# EAGLE design Battery_Monitoring_V3 (EAGLE 9.6.2)

## Sheet 1 of 2
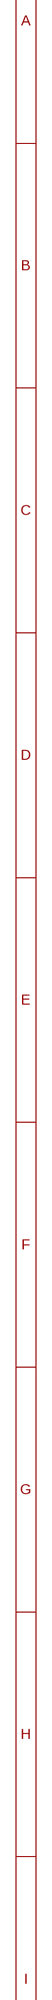
[diagram p0: schematic, sheet 1, part 1 of 2]
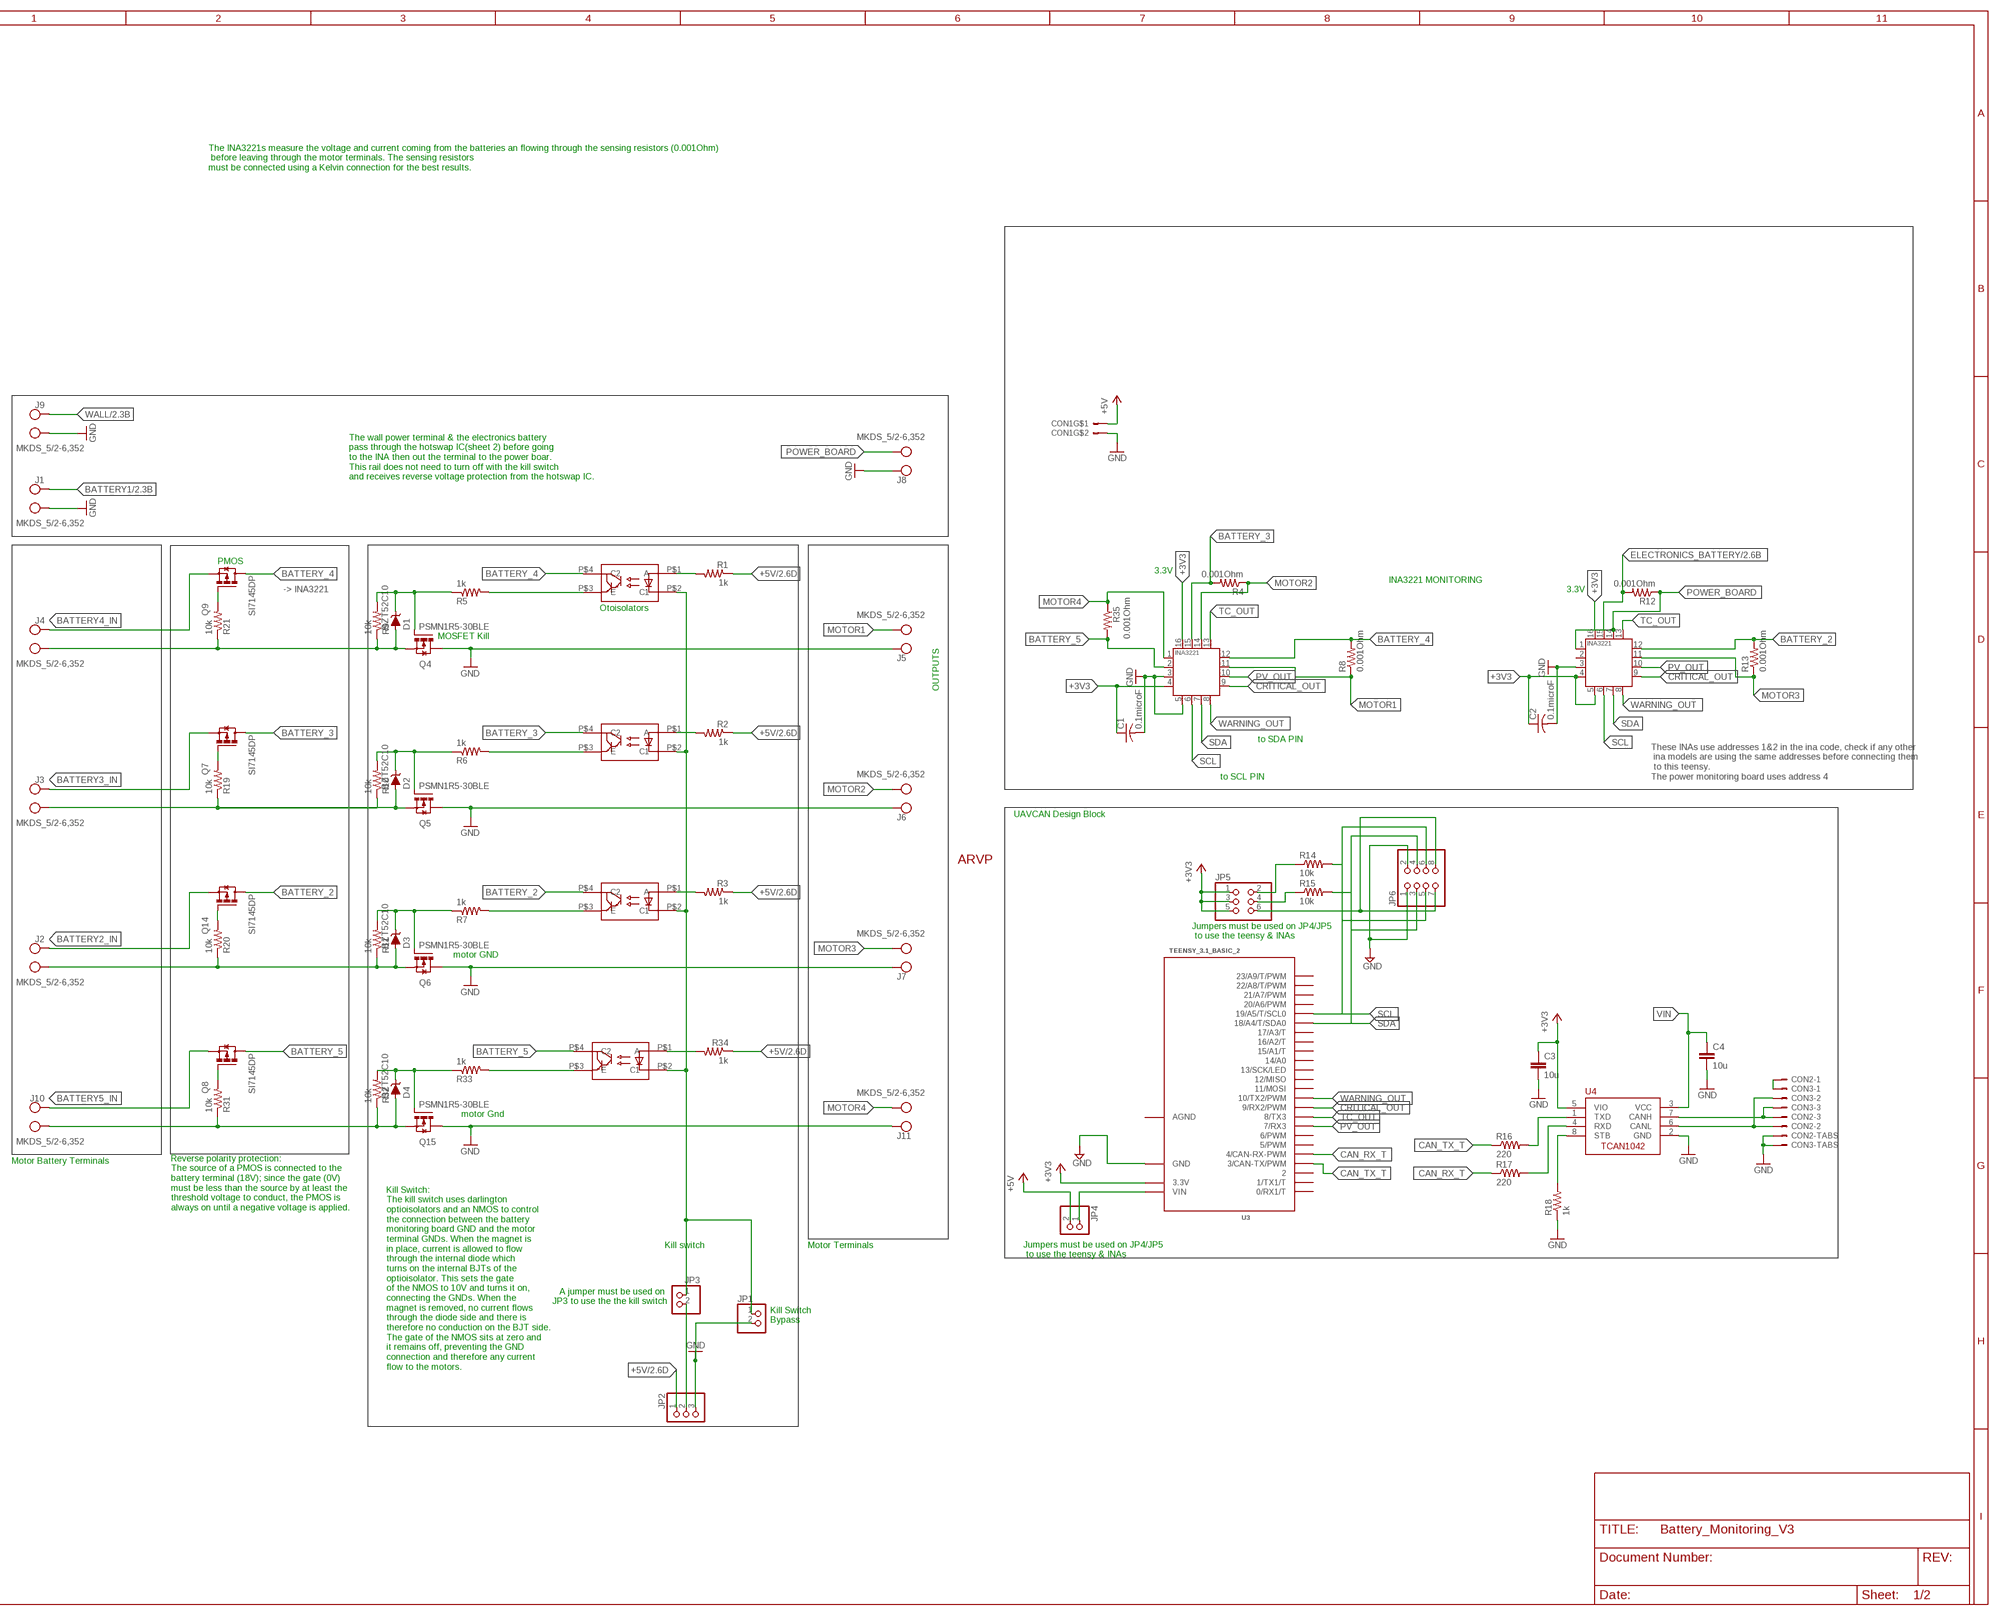
[diagram p1: schematic, sheet 1, part 2 of 2]

### Parts
ARVP1  ARVP_LOGO  [ARVP]
C1  0.1microF  C-USC2012  [C2012]
C2  0.1microF  C-USC2012  [C2012]
C3  10u  C-EUC0805  [C0805]
C4  10u  C-EUC0805  [C0805]
CON1  MOLEX_5566-2  [5566-2]
CON2  SM03B-GHS-TB  [SM03B-GHS-TB]
CON3  SM03B-GHS-TB  [SM03B-GHS-TB]
D1  BZT52C10  [SOD-123]
D2  BZT52C10  [SOD-123]
D3  BZT52C10  [SOD-123]
D4  BZT52C10  [SOD-123]
J1  MKDS_5/2-6,352  [MKDS_5/2-6,35]
J2  MKDS_5/2-6,352  [MKDS_5/2-6,35]
J3  MKDS_5/2-6,352  [MKDS_5/2-6,35]
J4  MKDS_5/2-6,352  [MKDS_5/2-6,35]
J5  MKDS_5/2-6,352  [MKDS_5/2-6,35]
J6  MKDS_5/2-6,352  [MKDS_5/2-6,35]
J7  MKDS_5/2-6,352  [MKDS_5/2-6,35]
J8  MKDS_5/2-6,352  [MKDS_5/2-6,35]
J9  MKDS_5/2-6,352  [MKDS_5/2-6,35]
J10  MKDS_5/2-6,352  [MKDS_5/2-6,35]
J11  MKDS_5/2-6,352  [MKDS_5/2-6,35]
JP1  PINHD-1X2  [1X02]
JP2  PINHD-1X3  [1X03]
JP3  PINHD-1X2  [1X02]
JP4  PINHD-1X2  [1X02]
JP5  PINHD-2X3  [2X03]
JP6  PINHD-2X4  [2X04]
Q1  TCLD1000CT  [SOP-4L]
Q2  TCLD1000CT  [SOP-4L]
Q3  TCLD1000CT  [SOP-4L]
Q4  PSMN1R5-30BLE  [SOT404/D2PAK]
Q5  PSMN1R5-30BLE  [SOT404/D2PAK]
Q6  PSMN1R5-30BLE  [SOT404/D2PAK]
Q7  SI7145DP  [SO-8/PPAK/TEST]
Q8  SI7145DP  [SO-8/PPAK/TEST]
Q9  SI7145DP  [SO-8/PPAK/TEST]
Q14  SI7145DP  [SO-8/PPAK/TEST]
Q15  PSMN1R5-30BLE  [SOT404/D2PAK]
Q16  TCLD1000CT  [SOP-4L]
R1  1k  R-US_R0805  [R0805]
R2  1k  R-US_R0805  [R0805]
R3  1k  R-US_R0805  [R0805]
R4  0.001Ohm  HCS3920FT1L00  [3920]
R5  1k  R-US_M1206  [M1206]
R6  1k  R-US_M1206  [M1206]
R7  1k  R-US_M1206  [M1206]
R8  0.001Ohm  HCS3920FT1L00  [3920]
R9  10k  R-US_M1206  [M1206]
R10  10k  R-US_M1206  [M1206]
R11  10k  R-US_M1206  [M1206]
R12  0.001Ohm  HCS3920FT1L00  [3920]
R13  0.001Ohm  HCS3920FT1L00  [3920]
R14  10k  R-US_R1206  [R1206]
R15  10k  R-US_R1206  [R1206]
R16  220  R-US_R0805  [R0805]
R17  220  R-US_R0805  [R0805]
R18  1k  R-US_R0805  [R0805]
R19  10k  R-US_M1206  [M1206]
R20  10k  R-US_M1206  [M1206]
R21  10k  R-US_M1206  [M1206]
R31  10k  R-US_M1206  [M1206]
R32  10k  R-US_M1206  [M1206]
R33  1k  R-US_M1206  [M1206]
R34  1k  R-US_R0805  [R0805]
R35  0.001Ohm  HCS3920FT1L00  [3920]
U1  INA3221.  [HVQFN16_4X4]
U2  INA3221.  [HVQFN16_4X4]
U3  TEENSY_3.1_BASIC_2  [TEENSY_3.1_BASIC_2]
U4  TCAN1042HVDR  [SO-8]

### Nets
+3V3: C1.1 C2.1 C3.1 JP5.1 JP5.3 JP5.5 U1.4(VS) U1.16(VPU) U2.4(VS) U2.5(A0) U2.16(VPU) U3.3.3V U4.5(VIO)
+5V: CON1.1 JP2.1 JP4.2 R1.1 R2.1 R3.1 R34.1 ; also sheet 2
BATT1GND: D1.P$2(A) J4.1(KL) Q4.3S(S) R9.1 R21.1
BATT2GND: D2.P$2(A) J3.1(KL) Q5.3S(S) R10.1 R19.1
BATT3GND: D3.P$2(A) J2.1(KL) Q6.3S(S) R11.1 R20.1
BATT5GND: D4.P$2(A) J10.1(KL) Q15.3S(S) R31.1 R32.1
BATTERY1: J1.2(KL1) ; also sheet 2
BATTERY2_IN: J2.2(KL1) Q14.S@1(S) Q14.S@2(S) Q14.S@3(S)
BATTERY3_IN: J3.2(KL1) Q7.S@1(S) Q7.S@2(S) Q7.S@3(S)
BATTERY4_IN: J4.2(KL1) Q9.S@1(S) Q9.S@2(S) Q9.S@3(S)
BATTERY5_IN: J10.2(KL1) Q8.S@1(S) Q8.S@2(S) Q8.S@3(S)
BATTERY_2: Q3.P$4(C2) Q14.D@1(D) Q14.D@2(D) Q14.D@3(D) Q14.D@4(D) Q14.D@5(D) R13.P$2 U2.12(IN+1)
BATTERY_3: Q2.P$4(C2) Q7.D@1(D) Q7.D@2(D) Q7.D@3(D) Q7.D@4(D) Q7.D@5(D) R4.P$2 U1.15(IN+2)
BATTERY_4: Q1.P$4(C2) Q9.D@1(D) Q9.D@2(D) Q9.D@3(D) Q9.D@4(D) Q9.D@5(D) R8.P$2 U1.12(IN+1)
BATTERY_5: Q8.D@1(D) Q8.D@2(D) Q8.D@3(D) Q8.D@4(D) Q8.D@5(D) Q16.P$4(C2) R35.P$2 U1.2(IN+3)
CAN_RX1: R17.2 U4.4(RXD)
CAN_RX_T: R17.1 U3.4(4/CAN-RX-PWM)
CAN_TX2: R16.2 U4.1(TXD)
CAN_TX_T: R16.1 U3.3(3/CAN-TX/PWM)
CANH1: CON2.P$3 CON3.P$3 U4.7(CANH)
CANL1: CON2.P$2 CON3.P$2 U4.6(CANL)
CANSH1: CON2.P$1 CON3.P$1
CRITICAL_OUT: U1.9(CRITICAL) U2.9(CRITICAL) U3.9(9/RX2/PWM)
E1: Q1.P$3(E) R5.2
E2: Q2.P$3(E) R6.2
E3: Q3.P$3(E) R7.2
ELECTRONICS_BATTERY: R12.P$2 U2.15(IN+2) ; also sheet 2
GND: C1.2 C2.2 C3.2 C4.2 CON1.2 CON2.P$4 CON2.P$5 CON3.P$4 CON3.P$5 J1.1(KL) J5.2(KL1) J6.2(KL1) J7.2(KL1) J8.2(KL1) J9.1(KL) J11.2(KL1) JP1.2 JP2.3 JP6.1 JP6.2 Q4.2D(D) Q5.2D(D) Q6.2D(D) Q15.2D(D) R18.1 U1.3(GND) U1.5(A0) U2.3(GND) U3.GND U4.2(GND) ; also sheet 2
I2C_3V1: JP5.6 JP6.7 JP6.8
MG1: D1.P$1(C) Q4.1G(G) R5.1 R9.2
MG2: D2.P$1(C) Q5.1G(G) R6.1 R10.2
MG3: D3.P$1(C) Q6.1G(G) R7.1 R11.2
MG4: D4.P$1(C) Q15.1G(G) R32.2 R33.1
MOTOR1: J5.1(KL) R8.P$1 U1.11(IN-1)
MOTOR2: J6.1(KL) R4.P$1 U1.14(IN-2)
MOTOR3: J7.1(KL) R13.P$1 U2.11(IN-1)
MOTOR4: J11.1(KL) R35.P$1 U1.1(IN-3)
N$1: Q1.P$1(A) R1.2
N$2: Q2.P$1(A) R2.2
N$3: Q3.P$1(A) R3.2
N$4: JP1.1 JP3.1 Q1.P$2(C1) Q2.P$2(C1) Q3.P$2(C1) Q16.P$2(C1)
N$5: JP2.2 JP3.2
N$6: Q7.G R19.2
N$7: Q14.G R20.2
N$9: Q9.G R21.2
N$10: Q8.G R31.2
N$15: Q16.P$3(E) R33.2
N$16: Q16.P$1(A) R34.2
POWER_BOARD: J8.1(KL) R12.P$1 U2.1(IN-3) U2.14(IN-2)
PV_OUT: U1.10(PV) U2.10(PV) U3.7(7/RX3)
SCL: JP6.5 JP6.6 R14.2 U1.6(SCL) U2.6(SCL) U3.19/A5(19/A5/T/SCL0)
SCL_3V1: JP5.2 R14.1
SDA: JP6.3 JP6.4 R15.2 U1.7(SDA) U2.7(SDA) U3.18/A4(18/A4/T/SDA0)
SDA_3V1: JP5.4 R15.1
STB1: R18.2 U4.8(STB)
TC_OUT: U1.13(TC) U2.13(TC) U3.8(8/TX3)
VIN: C4.1 JP4.1 U3.VIN U4.3(VCC)
WALL: J9.2(KL1) ; also sheet 2
WARNING_OUT: U1.8(WARNING) U2.8(WARNING) U3.10(10/TX2/PWM)
Unconnected: U2.2(IN+3) U3.0(0/RX1/T) U3.1(1/TX1/T) U3.2 U3.5(5/PWM) U3.6(6/PWM) U3.11(11/MOSI) U3.12(12/MISO) U3.13(13/SCK/LED) U3.14/A0 U3.15/A1(15/A1/T) U3.16/A2(16/A2/T) U3.17/A3(17/A3/T) U3.20/A6(20/A6/PWM) U3.21/A7(21/A7/PWM) U3.22/A8(22/A8/T/PWM) U3.23/A9(23/A9/T/PWM)

### Notes on the sheet
- The INA3221s measure the voltage and current coming from the batteries an flowing through the sensing resistors (0.001Ohm)
   before leaving through the motor terminals. The sensing resistors
  must be connected using a Kelvin connection for the best results.
- The wall power terminal & the electronics battery
  pass through the hotswap IC(sheet 2) before going 
  to the INA then out the terminal to the power boar. 
  This rail does not need to turn off with the kill switch 
  and receives reverse voltage protection from the hotswap IC.
- PMOS
- 3.3V
- INA3221 MONITORING
- -> INA3221 | 3.3V
- Otoisolators
- MOSFET Kill
- OUTPUTS
- to SDA PIN
- to SCL PIN
- These INAs use addresses 1&2 in the ina code, check if any other
   ina models are using the same addresses before connecting them
   to this teensy.
  The power monitoring board uses address 4
- UAVCAN Design Block
- Jumpers must be used on JP4/JP5
   to use the teensy & INAs
- motor GND
- motor Gnd
- Motor Battery Terminals
- Reverse polarity protection:
  The source of a PMOS is connected to the 
  battery terminal (18V); since the gate (0V) 
  must be less than the source by at least the 
  threshold voltage to conduct, the PMOS is 
  always on until a negative voltage is applied.
- Kill switch | Motor Terminals
- Jumpers must be used on JP4/JP5
   to use the teensy & INAs
- A jumper must be used on 
  JP3 to use the the kill switch
- Kill Switch 
  Bypass
- Kill Switch:
  The kill switch uses darlington 
  optioisolators and an NMOS to control 
  the connection between the battery 
  monitoring board GND and the motor 
  terminal GNDs. When the magnet is 
  in place, current is allowed to flow 
  through the internal diode which 
  turns on the internal BJTs of the 
  optioisolator. This sets the gate
  of the NMOS to 10V and turns it on,
  connecting the GNDs. When the 
  magnet is removed, no current flows 
  through the diode side and there is 
  therefore no conduction on the BJT side. 
  The gate of the NMOS sits at zero and 
  it remains off, preventing the GND 
  connection and therefore any current 
  flow to the motors.

## Sheet 2 of 2
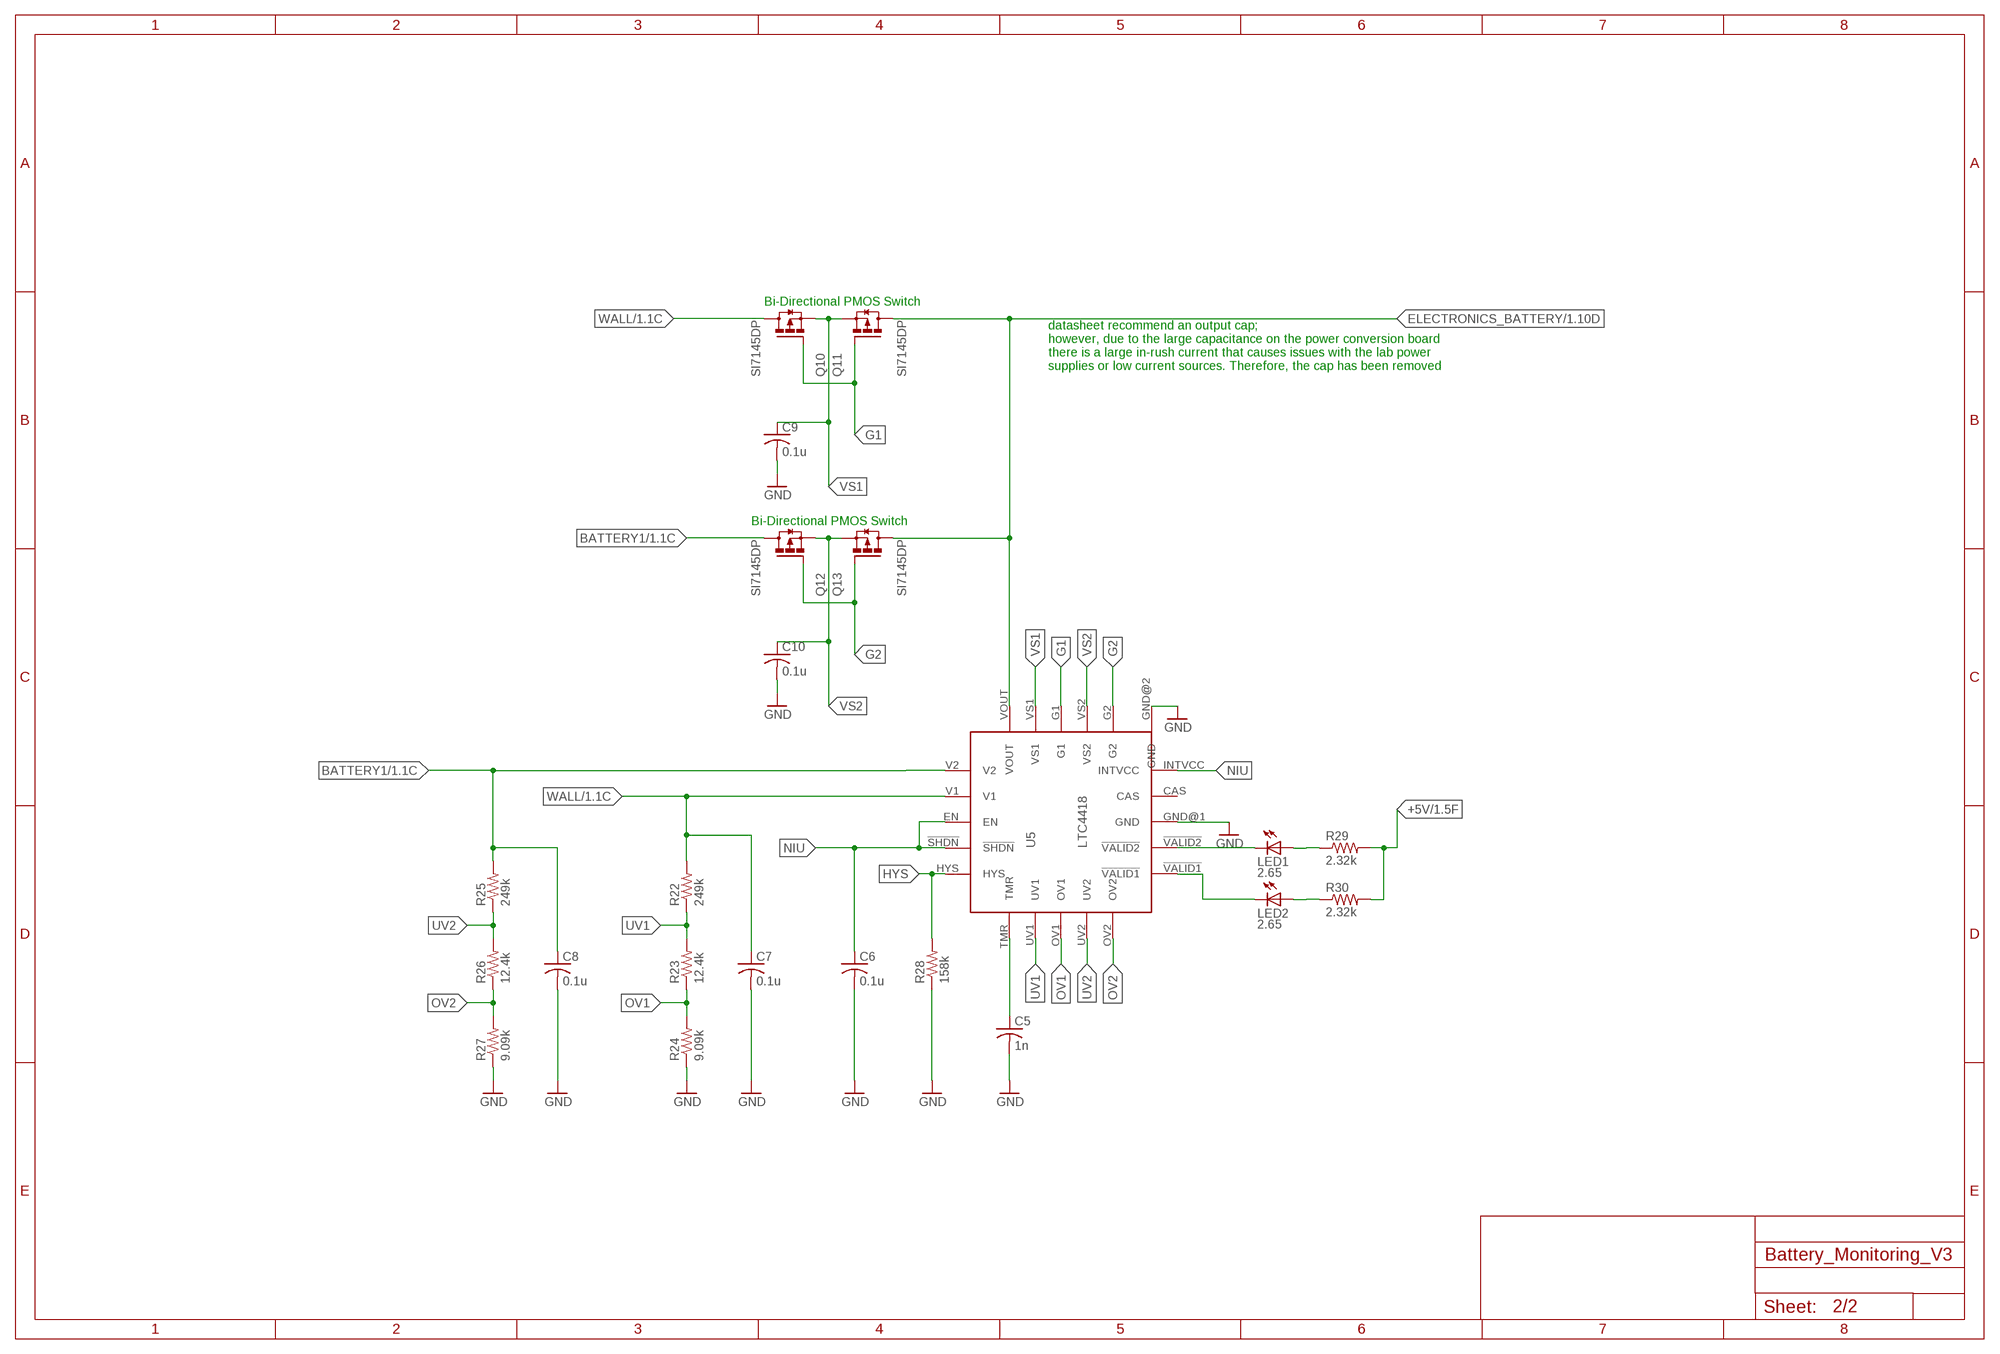
[diagram p2: schematic, sheet 2]

### Parts
C5  1n  C-USC0805  [C0805]
C6  0.1u  C-USC0805  [C0805]
C7  0.1u  C-USC0805  [C0805]
C8  0.1u  C-USC0805  [C0805]
C9  0.1u  C-USC0805  [C0805]
C10  0.1u  C-USC0805  [C0805]
LED1  2.65  LEDSML0805  [SML0805]
LED2  2.65  LEDSML0805  [SML0805]
Q10  SI7145DP  [SO-8/PPAK/TEST]
Q11  SI7145DP  [SO-8/PPAK/TEST]
Q12  SI7145DP  [SO-8/PPAK/TEST]
Q13  SI7145DP  [SO-8/PPAK/TEST]
R22  249k  R-US_R1206  [R1206]
R23  12.4k  R-US_R0805  [R0805]
R24  9.09k  R-US_R0805  [R0805]
R25  249k  R-US_R1206  [R1206]
R26  12.4k  R-US_R0805  [R0805]
R27  9.09k  R-US_R0805  [R0805]
R28  158k  R-US_R0805  [R0805]
R29  2.32k  R-US_R0805  [R0805]
R30  2.32k  R-US_R0805  [R0805]
U5  LTC4418  [20-QFN(4X4)]

### Nets
!VALID1: LED2.C U5.!VALID1
!VALID2: LED1.C U5.!VALID2
+5V: R29.2 R30.2 ; also sheet 1
BATTERY1: C8.1 Q12.D@1(D) Q12.D@2(D) Q12.D@3(D) Q12.D@4(D) Q12.D@5(D) R25.2 U5.V2 ; also sheet 1
ELECTRONICS_BATTERY: Q11.D@1(D) Q11.D@2(D) Q11.D@3(D) Q11.D@4(D) Q11.D@5(D) Q13.D@1(D) Q13.D@2(D) Q13.D@3(D) Q13.D@4(D) Q13.D@5(D) U5.VOUT ; also sheet 1
G1: Q10.G Q11.G U5.G1
G2: Q12.G Q13.G U5.G2
GND: C5.2 C6.2 C7.2 C8.2 C9.2 C10.2 R24.1 R27.1 R28.1 U5.GND@1(GND) U5.GND@2(GND) ; also sheet 1
HYS: R28.2 U5.HYS
N$8: LED1.A R29.1
N$11: LED2.A R30.1
N$14: C5.1 U5.TMR
NIU: C6.1 U5.!SHDN U5.EN U5.INTVCC
OV1: R23.1 R24.2 U5.OV1
OV2: R26.1 R27.2 U5.OV2
UV1: R22.1 R23.2 U5.UV1
UV2: R25.1 R26.2 U5.UV2
VS1: C9.1 Q10.S@1(S) Q10.S@2(S) Q10.S@3(S) Q11.S@1(S) Q11.S@2(S) Q11.S@3(S) U5.VS1
VS2: C10.1 Q12.S@1(S) Q12.S@2(S) Q12.S@3(S) Q13.S@1(S) Q13.S@2(S) Q13.S@3(S) U5.VS2
WALL: C7.1 Q10.D@1(D) Q10.D@2(D) Q10.D@3(D) Q10.D@4(D) Q10.D@5(D) R22.2 U5.V1 ; also sheet 1
Unconnected: U5.CAS

### Notes on the sheet
- Bi-Directional PMOS Switch
- datasheet recommend an output cap;
  however, due to the large capacitance on the power conversion board 
  there is a large in-rush current that causes issues with the lab power 
  supplies or low current sources. Therefore, the cap has been removed
- Bi-Directional PMOS Switch

## Power pins joined to a net without a drawn wire
AGND: U3.AGND

## Library data of the parts
ARVP1 = ARVP:ARVP_LOGO
C1 C2 = resistor:C-US: CAPACITOR, American symbol
C3 C4 = rcl:C-EU: CAPACITOR, European symbol
C5-C10 = adafruit:C-US: CAPACITOR, American symbol
CON1 = ARVP:MOLEX_5566-2
CON2 CON3 = ARVP:SM03B-GHS-TB
D1-D4 = Moira:BZT52C10: DIODE ZENER 10V 500MW SOD123 by Diodes Incorporated Digikey: BZT52C10-FDICT-ND
J1-J11 = Moira:MKDS_5/2-6,35: CONN TERM BLOCK 2POS 6.35MM PCB, 2 Position Wire to Board Terminal Block Horizontal with Board 0.250" (6.35mm) Through Hole, Phoenix Contact (1714955), Digikey:277-1269-ND, MKDS 5/2-6,35 package adpated from Eagle library package MKDS 5/3-6,35
JP1 JP3 JP4 = pinhead:PINHD-1X2: PIN HEADER
JP2 = pinhead:PINHD-1X3: PIN HEADER
JP5 = pinhead:PINHD-2X3: PIN HEADER
JP6 = pinhead:PINHD-2X4: PIN HEADER
LED1 LED2 = led:LED: LED OSRAM: - CHIPLED LG R971, LG N971, LY N971, LG Q971, LY Q971, LO R971, LY R971 LH N974, LH R974 LS Q976, LO Q976, LY Q976 LO Q996 - Hyper CHIPLED LW Q18S LB Q993, LB Q99A, LB R99A - SideLED LS A670, LO A670, LY A670, LG A670, LP A670 LB A673, LV A673, LT A673, LW A673 LH A674 LY A675 LS A676, LA A676, LO A676, LY A676, LW A676 LS A679, LY A679, LG A679 - Hyper Micro SIDELED® LS Y876, LA Y876, LO Y876, LY Y876 LT Y87S - SmartLED LW L88C, LW L88S LB L89C, LB L89S, LG L890 LS L89K, LO L89K, LY L89K LS L896, LA L896, LO L896, LY L896 - TOPLED LS T670, LO T670, LY T670, LG T670, LP T670 LSG T670, LSP T670, LSY T670, LOP T670, LYG T670 LG T671, LOG T671, LSG T671 LB T673, LV T673, LT T673, LW T673 LH T674 LS T676, LA T676, LO T676, LY T676, LB T676, LH T676, LSB T676, LW T676 LB T67C, LV T67C, LT T67C, LS T67K, LO T67K, LY T67K, LW E67C LS E67B, LA E67B, LO E67B, LY E67B, LB E67C, LV E67C, LT E67C LW T67C LS T679, LY T679, LG T679 LS T770, LO T770, LY T770, LG T770, LP T770 LB T773, LV T773, LT T773, LW T773 LH T774 LS E675, LA E675, LY E675, LS T675 LS T776, LA T776, LO T776, LY T776, LB T776 LHGB T686 LT T68C, LB T68C - Hyper Mini TOPLED® LB M676 - Mini TOPLED Santana® LG M470 LS M47K, LO M47K, LY M47K Source: http://www.osram.convergy.de LUXEON: - LUMILED® LXK2-PW12-R00, LXK2-PW12-S00, LXK2-PW14-U00, LXK2-PW14-V00 LXK2-PM12-R00, LXK2-PM12-S00, LXK2-PM14-U00 LXK2-PE12-Q00, LXK2-PE12-R00, LXK2-PE12-S00, LXK2-PE14-T00, LXK2-PE14-U00 LXK2-PB12-K00, LXK2-PB12-L00, LXK2-PB12-M00, LXK2-PB14-N00, LXK2-PB14-P00, LXK2-PB14-Q00 LXK2-PR12-L00, LXK2-PR12-M00, LXK2-PR14-Q00, LXK2-PR14-R00 LXK2-PD12-Q00, LXK2-PD12-R00, LXK2-PD12-S00 LXK2-PH12-R00, LXK2-PH12-S00 LXK2-PL12-P00, LXK2-PL12-Q00, LXK2-PL12-R00 Source: www.luxeon.com KINGBRIGHT: KA-3528ASYC Source: www.kingbright.com
Q1 = Moira:TCLD1000CT: OPTOISOLTR 5KV DARLINGTON 4-SOP by VISHAY Digikey: TCLD1000CT_ND; SPICEPREFIX: E
Q2 Q3 Q16 = Moira:TCLD1000CT: OPTOISOLTR 5KV DARLINGTON 4-SOP by VISHAY Digikey: TCLD1000CT_ND
Q4-Q6 Q15 = Moira:PSMN1R5-30BLE: N-channel 30 V 1.5 mΩ logic level MOSFET in D2PAK by Nexperia USA Inc. Digikey: 1727-1101-1-ND
Q7-Q9 Q14 = Si7145DP:SI7145DP: MOSFET P-CH 30V 60A PPAK SO-8 Digikey: SI7145DP-T1-GE3CT-ND; MPN: SI7145DP-T1-GE3; OC_NEWARK: 63R6006
Q10-Q13 = Moira:SI7145DP: MOSFET P-CH 30V 60A PPAK SO-8 Digikey: SI7145DP-T1-GE3CT-ND
R1-R3 R5-R7 R9-R11 R22-R30 R32-R34 = adafruit:R-US_: RESISTOR, American symbol
R4 R8 R12 R13 R35 = Moira:HCS3920: 0.001 Ohm ±1% 5W Chip Resistor 4020 Automotive AEC-Q200, Current Sense, Moisture Resistant Metal Element Stackpole Electronics Inc. Digikey: HCS3920FT1L00CT-ND
R14-R18 = rcl:R-US_: RESISTOR, American symbol
R19-R21 R31 = adafruit:R-US_: RESISTOR, American symbol; MPN: RC0603FR-0710KL; OC_NEWARK: 68R0049
U1 U2 = INA3221:INA3221: The INA3221 is a three-channel, high-side current and bus voltage monitor with an I 2C- and SMBUScompatible interface. The INA3221 monitors both shunt voltage drops and bus supply voltages, in addition to having programmable conversion times and averaging modes for these signals. The INA3221 offers both critical and warning alerts to detect multiple programmable out-of-range conditions for each channel.
U3 = Teensy_3_Series_Board_v1.0:TEENSY_3.1_BASIC_2: Footprint for Teensy 3.1 board using all pin connections on the outer perimeter
U4 = ARVP:TCAN1042HVDR
U5 = Moira:LTC4418: OR Controller Source Selector Switch P-Channel 2:1 20-QFN (4x4) Digikey: LTC4418IUF#PBF-ND

## Net classes
1 net1: clearance 0.203 mm to class 0

## Board
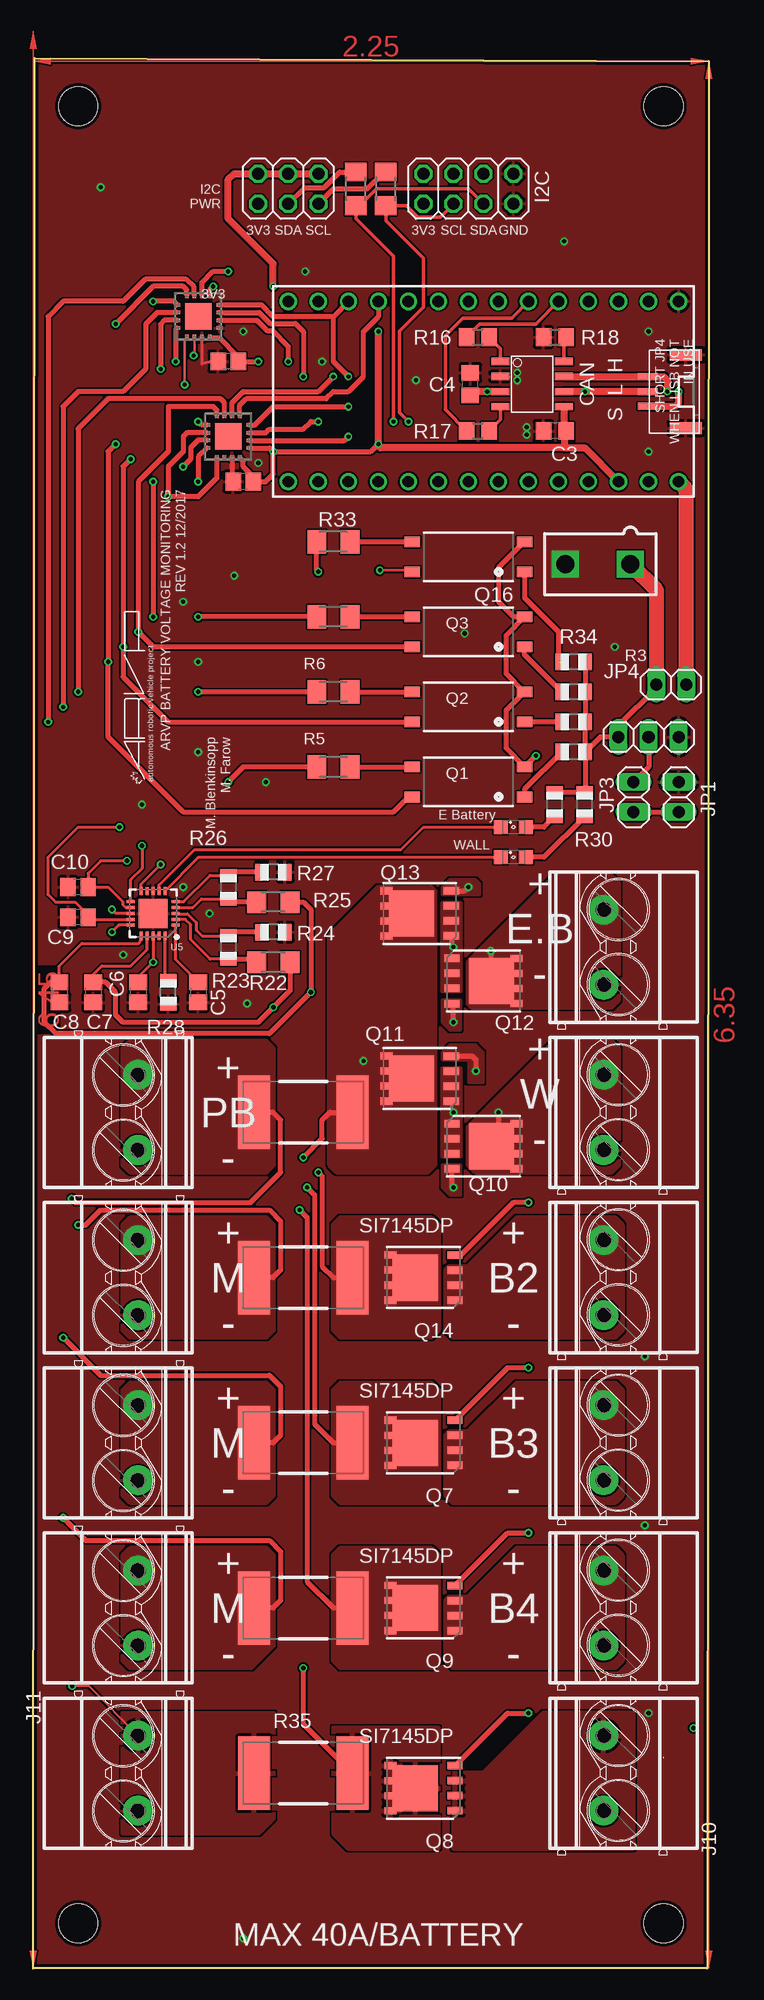
[diagram p3: board, top side]
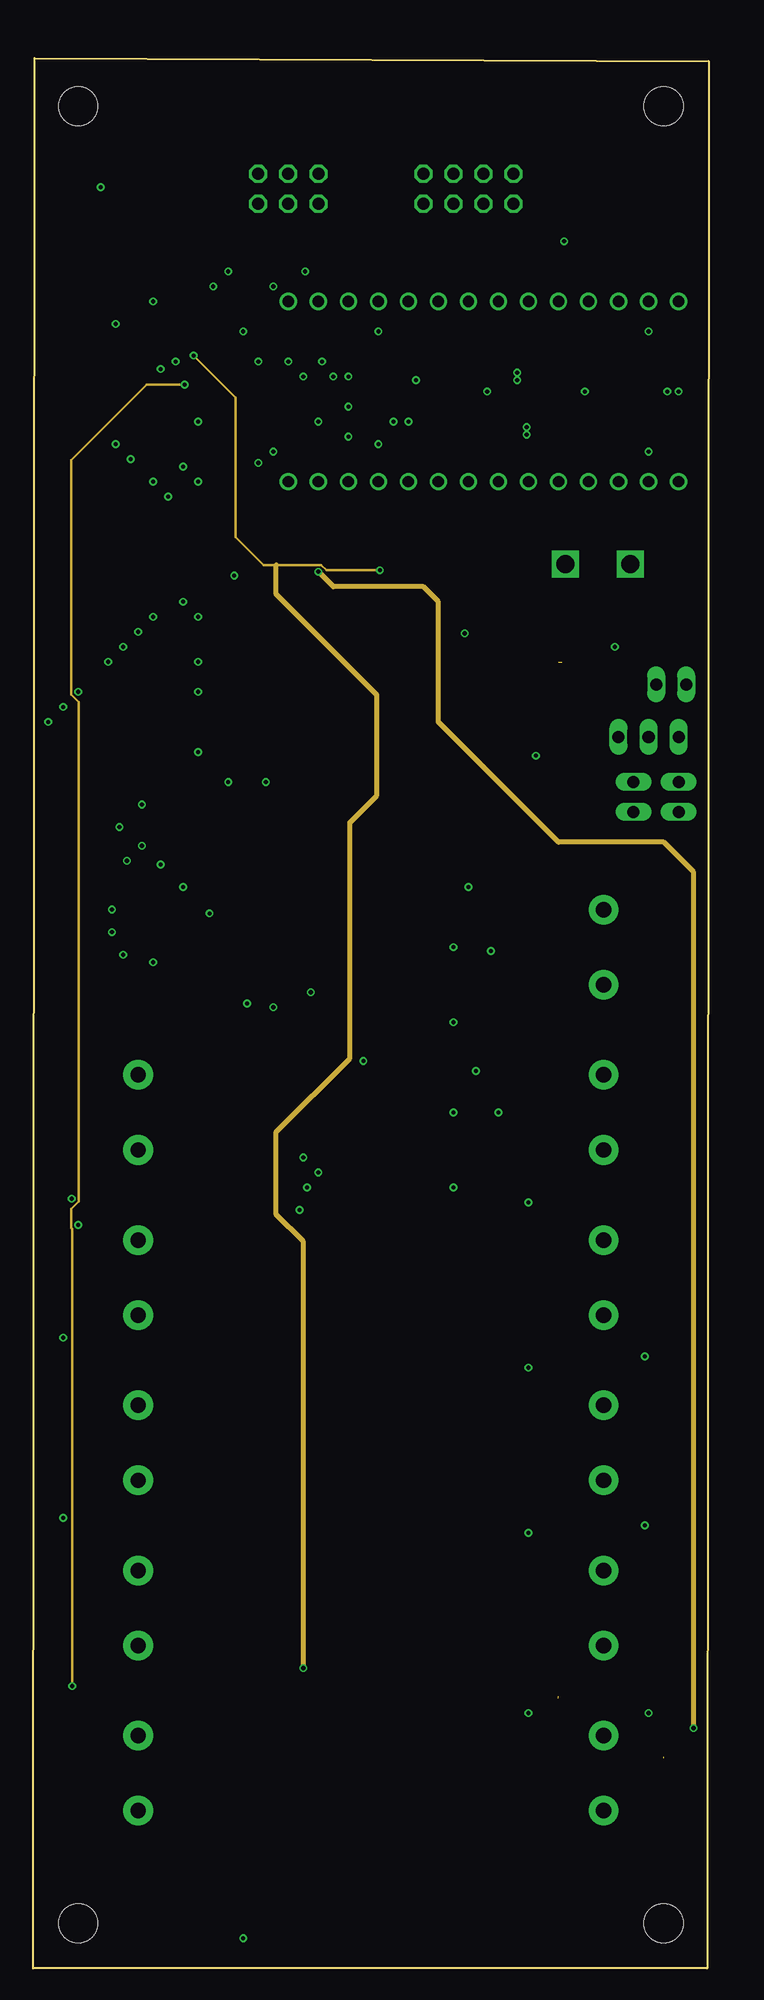
[diagram p4: board, inner layer Route2]
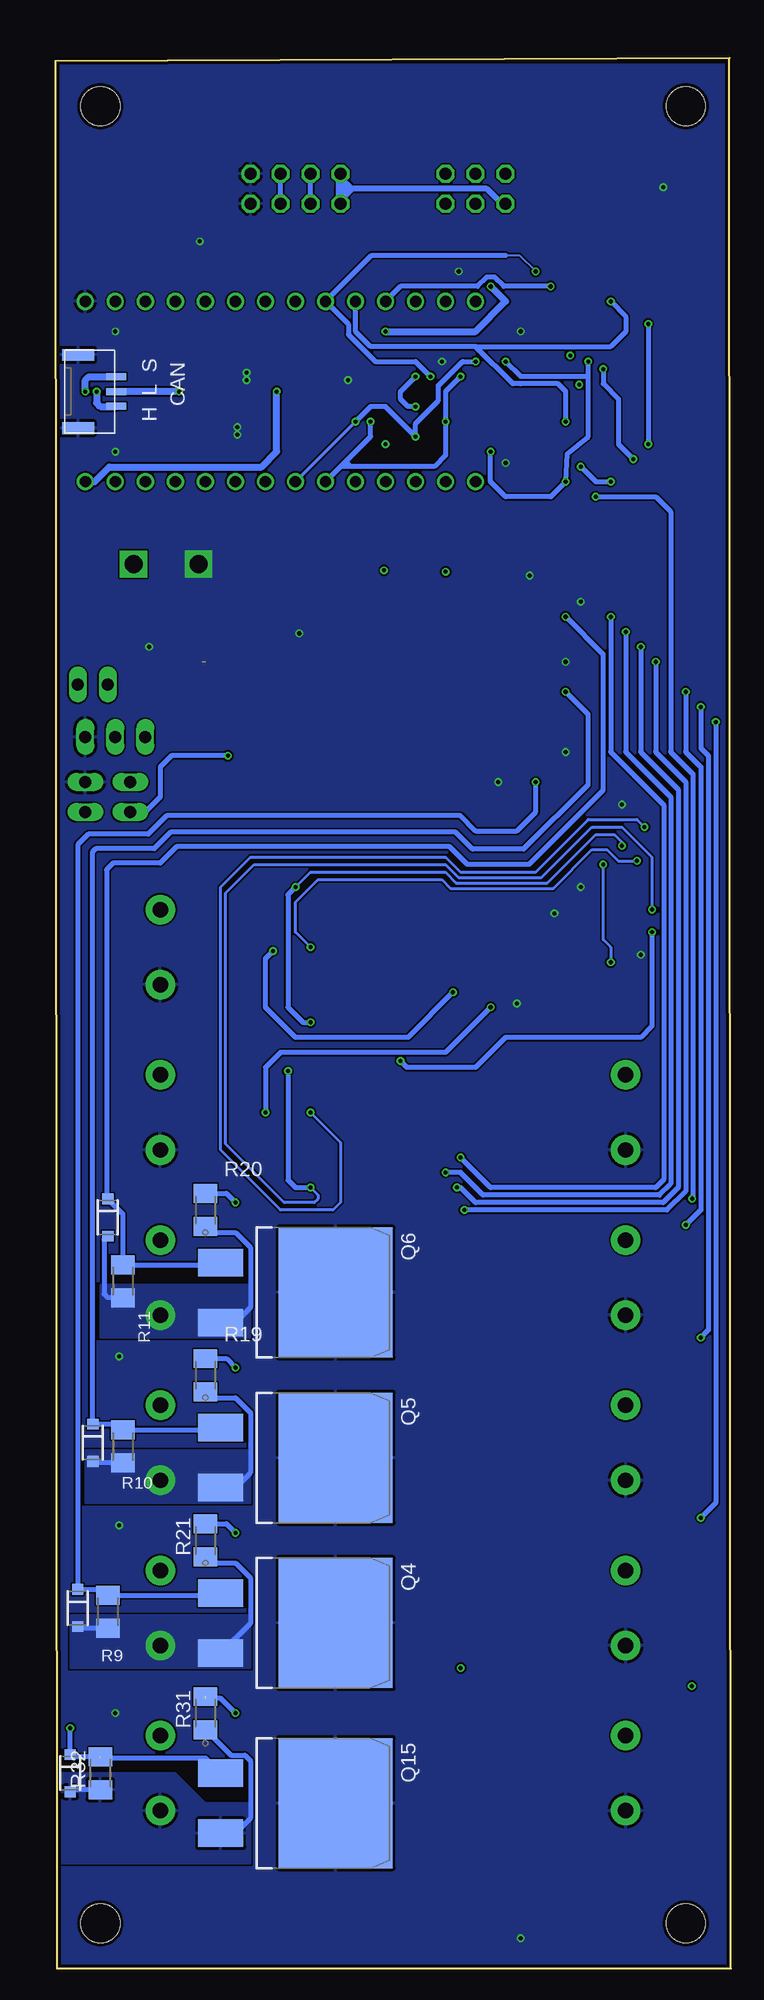
[diagram p5: board, bottom side, seen from below]

Size 57.15 x 161.54 mm. Coordinates in mm from the lower left corner, seen from the top.
Outline: 0.13,161.54 57.15,161.29 57.02,0 0,0 0.13,161.54
Copper layers (1+2*15+16): Top 0.035mm / dielectric 1.5mm / Route2 0.035mm / dielectric 0.15mm / Route15 0.035mm / dielectric 0.2mm / Bottom 0.035mm
Design rules "JLCPCB2Layer *": minimum track width 6mil, minimum drill 10mil, track to track 6mil, track to pad 6mil, pad to pad 6mil, via to via 6mil, smd to smd 0mil, copper to edge 10mil, drill to drill 10mil, minimum pad ring 6mil, minimum via ring 6mil, stop-mask expansion 2mil, vias tented up to drill 100mil, thermal gap 10mil

### Footprints (pad centres in the part's own frame; a part is rotated, then mirrored left to right if it is on the bottom)
C2012 = smd 1.3 x 1.5: 1 -0.85,0; 2 0.85,0
C0805 = smd 1.3 x 1.5: 1 -0.95,0; 2 0.95,0
C0805' = smd 1.3 x 1.5: 1 -0.85,0; 2 0.85,0
5566-2 = drill 1.524 square: 1 0,-2.756; 2 0,2.756
SM03B-GHS-TB = smd 0.6 x 1.7: P$1 -1.25,0.85; P$2 0,0.85; P$3 1.25,0.85 | smd 1 x 2.7: P$4 -3.1,-2.35; P$5 3.1,-2.35
SOD-123 = smd 0.9 x 0.95: P$1 -1.575,0; P$2 1.575,0
MKDS_5/2-6,35 = drill 1.3 pad 2.5: 1 -3.175,0; 2 3.175,0
1X02 = drill 1.016 long: 1 -1.27,0; 2 1.27,0
1X03 = drill 1.016 long: 1 -2.54,0; 2 0,0; 3 2.54,0
2X03 = drill 1.016 octagon: 1 -2.54,-1.27; 2 -2.54,1.27; 3 0,-1.27; 4 0,1.27; 5 2.54,-1.27; 6 2.54,1.27
2X04 = drill 1.016 octagon: 1 -3.81,-1.27; 2 -3.81,1.27; 3 -1.27,-1.27; 4 -1.27,1.27; 5 1.27,-1.27; 6 1.27,1.27; 7 3.81,-1.27; 8 3.81,1.27
SML0805 = smd 1.2 x 1.2: A 1.05,0; C -1.05,0
SOP-4L = smd 1.3 x 0.9: P$1 -4.75,1.27; P$2 -4.75,-1.27; P$3 4.75,-1.27; P$4 4.75,1.27
SOT404/D2PAK = smd 2.32 x 3.81: 1G -2.54,-6.32; 3S 2.54,-6.32 | smd 11 x 9.65: 2D 0,3.4
SO-8/PPAK/TEST = smd 1.02 x 0.61: D@1 2.795,-1.905; D@2 2.795,-0.635; D@3 2.795,0.635; D@4 2.795,1.905 | smd 3.81 x 3.91: D@5 0.69,0 | smd 1.27 x 0.635: G -2.67,-1.905; S@1 -2.67,1.905; S@2 -2.67,0.635; S@3 -2.67,-0.635
R0805 = smd 1.1 x 1.4: 1 -1,0; 2 1,0
3920 = smd 2.7 x 6.2: P$1 -4.15,0; P$2 4.15,0
M1206 = smd 1.6 x 2: 1 -1.4,0; 2 1.4,0
R1206 = smd 1.6 x 1.803: 1 -1.422,0; 2 1.422,0
R0805' = smd 1.3 x 1.5: 1 -0.95,0; 2 0.95,0
HVQFN16_4X4 = smd 0.5 x 0.3: 1 -1.8,0.975; 2 -1.8,0.325; 3 -1.8,-0.325; 4 -1.8,-0.975; 9 1.8,-0.975; 10 1.8,-0.325; 11 1.8,0.325; 12 1.8,0.975 | smd 0.3 x 0.5: 5 -0.975,-1.8; 6 -0.325,-1.8; 7 0.325,-1.8; 8 0.975,-1.8; 13 0.975,1.8; 14 0.325,1.8; 15 -0.325,1.8; 16 -0.975,1.8 | smd 2.25 x 2.25: TH 0,0
TEENSY_3.1_BASIC_2 = drill 0.965: 0 -7.62,13.97; 1 -7.62,11.43; 2 -7.62,8.89; 3 -7.62,6.35; 3.3V 7.62,11.43; 4 -7.62,3.81; 5 -7.62,1.27; 6 -7.62,-1.27; 7 -7.62,-3.81; 8 -7.62,-6.35; 9 -7.62,-8.89; 10 -7.62,-11.43; 11 -7.62,-13.97; 12 -7.62,-16.51; 13 7.62,-16.51; 14/A0 7.62,-13.97; 15/A1 7.62,-11.43; 16/A2 7.62,-8.89; 17/A3 7.62,-6.35; 18/A4 7.62,-3.81; 19/A5 7.62,-1.27; 20/A6 7.62,1.27; 21/A7 7.62,3.81; 22/A8 7.62,6.35; 23/A9 7.62,8.89; AGND 7.62,13.97; GND -7.62,16.51; VIN 7.62,16.51
SO-8 = smd 1.524 x 0.61: 1 -2.692,1.905; 2 -2.692,0.635; 3 -2.692,-0.635; 4 -2.692,-1.905; 5 2.692,-1.905; 6 2.692,-0.635; 7 2.692,0.635; 8 2.692,1.905
20-QFN(4X4) = smd 0.25 x 0.7: !SHDN -0.5,1.9; !VALID1 -1,-1.9; !VALID2 -0.5,-1.9; CAS 0.5,-1.9; EN 0,1.9; GND@1 0,-1.9; HYS -1,1.9; INTVCC 1,-1.9; V1 0.5,1.9; V2 1,1.9 | smd 0.7 x 0.25: G1 1.9,0; G2 1.9,-1; OV1 -1.9,0; OV2 -1.9,-1; TMR -1.9,1; UV1 -1.9,0.5; UV2 -1.9,-0.5; VOUT 1.9,1; VS1 1.9,0.5; VS2 1.9,-0.5 | smd 2.45 x 2.45: GND@2 0,0
STAND-OFF = hole 3.302: 0,0

### Placement (x,y rotation side)
ARVP1  10.16,100.33 90 top
C1  16.51,135.89 180 top
C2  17.78,125.73 180 top
C3  44.13,130.02 180 top
C4  36.99,133.99 90 top
C5  1n  [C0805']  13.97,82.55 270 top
C6  0.1u  [C0805']  8.89,82.55 270 top
C7  0.1u  [C0805']  5.08,82.55 270 top
C8  0.1u  [C0805']  2.22,82.55 270 top
C9  0.1u  [C0805']  3.81,88.9 180 top
C10  0.1u  [C0805']  3.81,91.44 180 top
CON1  47.78,118.74 90 top
CON2  52.86,133.35 90 top
CON3  52.86,133.35 270 bottom
D1  55.24,30.48 270 bottom
D2  53.98,44.45 270 bottom
D3  52.7,63.5 270 bottom
D4  55.88,16.51 270 bottom
J1  48.26,86.36 90 top
J2  48.26,58.42 90 top
J3  48.26,44.45 90 top
J4  48.26,30.48 90 top
J5  8.89,30.48 270 top
J6  8.89,44.45 270 top
J7  8.89,58.42 270 top
J8  8.89,72.39 270 top
J9  48.26,72.39 90 top
J10  48.26,16.51 90 top
J11  8.89,16.51 270 top
JP1  54.61,99.06 90 top
JP2  52.07,104.14 0 top
JP3  50.8,99.06 90 top
JP4  53.98,108.58 180 top
JP5  21.59,150.5 180 top
JP6  36.83,150.5 180 top
LED1  40.64,96.52 0 top
LED2  40.64,93.98 0 top
Q1  36.83,100.33 180 top
Q2  36.83,106.68 180 top
Q3  36.83,113.03 180 top
Q4  36.83,29.21 270 bottom
Q5  36.83,43.18 270 bottom
Q6  36.83,57.15 270 bottom
Q7  33.02,44.45 180 top
Q8  33.02,15.24 180 top
Q9  33.02,30.48 180 top
Q10  38.1,69.53 0 top
Q11  32.7,75.25 180 top
Q12  38.1,83.5 0 top
Q13  32.7,89.22 180 top
Q14  33.02,58.42 180 top
Q15  36.83,13.97 270 bottom
Q16  36.83,119.38 180 top
R1  45.72,102.87 180 top
R2  45.72,105.41 180 top
R3  45.72,107.95 180 top
R4  22.86,44.45 0 top
R5  25.4,101.6 0 top
R6  25.4,107.95 0 top
R7  25.4,114.3 0 top
R8  22.86,30.48 0 top
R9  52.7,30.16 90 bottom
R10  51.43,44.13 90 bottom
R11  51.43,58.1 90 bottom
R12  22.86,72.39 0 top
R13  22.86,58.42 0 top
R14  29.85,150.5 270 top
R15  27.31,150.5 270 top
R16  220  [R0805']  37.62,137.95 0 top
R17  220  [R0805']  37.62,130.02 0 top
R18  1k  [R0805']  44.13,137.95 0 top
R19  44.45,50.16 90 bottom
R20  44.45,64.13 90 bottom
R21  44.45,36.2 90 bottom
R22  20.32,85.09 0 top
R23  16.51,86.36 270 top
R24  20.32,87.63 180 top
R25  20.32,90.17 0 top
R26  16.51,91.44 270 top
R27  20.32,92.71 180 top
R28  11.43,82.55 90 top
R29  44.13,98.42 90 top
R30  46.67,98.42 90 top
R31  44.45,21.59 90 bottom
R32  53.34,16.51 90 bottom
R33  25.4,120.65 0 top
R34  45.72,110.49 180 top
R35  22.86,16.51 0 top
U1  13.97,139.7 90 top
U2  16.51,129.54 90 top
U3  38.1,133.35 270 top
U4  42.23,133.99 0 top
U5  10.16,89.22 180 top
U$18  [STAND-OFF]  53.34,157.48 90 top
U$24  [STAND-OFF]  53.34,3.81 90 top
U$25  [STAND-OFF]  3.81,3.81 90 top
U$26  [STAND-OFF]  3.81,157.48 90 top

### Tracks (layer width: path | path; a pad name or v marks a point on that pad's centre or on a via)
!VALID1
  Top 0.254: U5.!VALID1 13.97,93.93 13.97,93.98 LED2.C
!VALID2
  Top 0.254: U5.!VALID2 10.66,91.62 13.65,94.61 31.12,94.61 33.02,96.52 LED1.C
+3V3  (via drill 0.35)
  Top 0.406: U2.4 17.78,127.45 17.78,127 18.63,126.15 C2.1 19.69,125.73 20.32,126.36 v20.32,128.27 | U1.4 15.77,137.9 17.36,136.31 C1.1 v19.05,135.89 | U1.16 12.06,138.62 v12.06,135.89 | U2.16 13.97,127.83 v13.97,125.73 | v20.32,128.27 20.03,128.56 U2.5 | v20.32,128.27 28.58,128.27 v29.21,128.91
  Top 0.61: JP5.1 JP5.3 JP5.5 16.99,151.77 16.51,151.29 16.51,147.96 20.32,144.15 v20.32,142.24 | U3.3.3V 46.67,128.59 44.93,128.59 | 44.93,128.59 29.37,128.59 29.21,128.75 v29.21,128.91 v29.21,138.43 | U4.5 44.92,130.18 C3.1 44.93,129.86 44.93,128.59
  Bottom 0.406: 12.06,134.62 v12.06,135.89 | 12.06,134.62 17.78,134.62 v19.05,135.89 | v20.32,128.27 20.32,125.73 19.05,124.46 15.24,124.46 v13.97,125.73 13.81,128.11 12.06,129.54 12.06,134.62
  Bottom 0.61: v20.32,142.24 19.05,140.97 21.59,138.43 v29.21,138.43
+5V
  Top 0.406: JP4.2 52.7,108.27 49.53,105.09 JP2.1 47.99,104.14 R1.1 | R1.1 46.72,99.47 R30.2 R29.2 | R1.1 R2.1 R3.1 R34.1
  Top 1.27: CON1.1 52.7,116.58 JP4.2
BATT1GND
  Bottom 0.406: Q4.3S 40.64,29.18 40.64,33.02 41.91,34.29 43.95,34.29 R21.1 | R9.1 55.1,28.76 D1.P$2
  pour Bottom (no thermals): 55.88,29.84 55.88,25.4 40.64,25.4 40.64,29.84
BATT2GND
  Bottom 0.406: R10.1 53.83,42.73 D2.P$2 | R19.1 43.95,48.26 41.91,48.26 40.64,46.99 40.64,41.91 41.91,40.64 Q5.3S
  pour Bottom (no thermals): 54.61,43.82 54.61,39.37 40.64,39.37 40.64,43.82
BATT3GND
  Bottom 0.406: D3.P$2 53.02,61.61 53.02,57.02 52.7,56.7 R11.1 | R20.1 43.95,62.23 41.91,62.23 40.64,60.96 40.64,55.88 41.91,54.61 Q6.3S
  pour Bottom (no thermals): 53.34,57.79 53.34,53.34 40.64,53.34 40.64,57.79
BATT5GND
  Bottom 0.406: R32.1 55.7,15.11 D4.P$2 | R31.1 42.29,18.03 41.1,18.03 40.64,17.57 40.64,12.7 41.91,11.43 42.54,12.06
  pour Bottom: 40.64,13.97 44.45,13.97 46.99,16.51 57.15,16.51 57.15,8.89 40.64,8.89
BATTERY1  (via drill 0.35)
  Top 0.254: C8.1 2.22,84.77 4.13,86.68 8.89,86.68 9.16,86.95 U5.V2
  Top 0.406: R25.2 22.86,90.17 23.5,89.53 v23.5,82.55 20,79.06 1.91,79.06 0.95,80.01 0.95,82.87 1.48,83.4 C8.1 | v38.73,86.04 38.73,83.56 Q12.D@5
  Bottom 0.406: v23.5,82.55 27.31,78.74 36.83,78.74 39.37,81.28 39.37,85.41 v38.73,86.04
  pour Top (no thermals): 48.89,81.28 37.15,81.28 36.83,81.6 36.83,85.09 44.13,92.39 48.89,92.39 49.53,91.76 49.53,81.91
BATTERY2_IN
  pour Top (no thermals): 49.85,62.87 49.85,53.98 49.21,53.34 35.56,53.34 34.92,53.98 34.92,59.05 35.24,59.37 36.83,59.37 40.96,63.5 49.21,63.5
BATTERY3_IN
  pour Top (no thermals): 49.85,48.9 49.85,40.01 49.21,39.37 35.56,39.37 34.92,40.01 34.92,45.09 35.24,45.4 36.83,45.4 40.96,49.53 49.21,49.53
BATTERY4_IN
  pour Top (no thermals): 49.85,34.93 49.85,26.04 49.21,25.4 35.56,25.4 34.92,26.04 34.92,31.11 35.24,31.43 36.83,31.43 40.96,35.56 49.21,35.56
BATTERY5_IN
  pour Top: 35.56,16.51 35.56,10.16 50.8,10.16 50.8,21.59 43.18,21.59 38.1,16.51
BATTERY_2  (via drill 0.35)
  Top 0.406: U2.12 15.54,131.78 15.24,132.08 11.43,132.08 11.43,128.27 8.89,125.73 v8.89,113.03 10.16,111.76 Q3.P$4 | v24.13,67.31 24.45,66.99 24.45,59.37 25.4,58.42 R13.P$2
  Bottom 0.406: v8.89,113.03 8.89,102.87 5.08,99.06 5.08,66.36 6.03,65.41 20.96,65.41 22.86,67.31 v24.13,67.31
  pour Top (no thermals): 34.29,62.87 34.29,53.98 33.66,53.34 26.04,53.34 25.4,53.98 25.4,62.87 26.04,63.5 33.66,63.5
BATTERY_3  (via drill 0.35)
  Top 0.406: U1.15 11.11,139.38 10.77,139.04 10.77,135.28 v10.79,135.25 | v8.26,127.64 7.62,127 v7.62,111.76 7.62,109.22 11.43,105.41 Q2.P$4 | R4.P$2 25.4,44.45 23.81,46.04 23.81,65.41 v23.18,66.04
  Bottom 0.406: v10.79,135.25 10.79,134 9.51,132.72 9.51,128.89 v8.26,127.64 | v7.62,111.76 7.62,102.87 4.45,99.69 4.45,66.04 5.71,64.77 21.59,64.77 22.86,66.04 v23.18,66.04
  pour Top (no thermals): 34.29,48.9 34.29,40.01 33.66,39.37 26.04,39.37 25.4,40.01 25.4,48.9 26.04,49.53 33.66,49.53
BATTERY_4  (via drill 0.35)
  Top 0.406: U1.12 12.99,141.95 12.7,142.24 10.16,142.24 v6.98,139.06 | v6.98,128.91 6.35,128.27 v6.35,110.49 6.35,104.14 12.7,97.79 30.48,97.79 31.75,99.06 Q1.P$4 | R8.P$2 25.4,30.48 23.18,32.7 23.18,63.5 v22.54,64.13
  Bottom 0.406: v6.98,139.06 v6.98,128.91 | v6.35,110.49 6.35,102.87 3.81,100.33 3.81,65.72 5.4,64.13 v22.54,64.13
  pour Top (no thermals): 34.29,34.93 34.29,26.04 33.66,25.4 26.04,25.4 25.4,26.04 25.4,34.93 26.04,35.56 33.66,35.56
BATTERY_5  (via drill 0.35)
  Top 0.203: U1.2 13.64,136.45 v13.59,136.4 | v29.34,118.24 31.95,118.24 Q16.P$4
  Top 0.406: R35.P$2 22.86,20.66 v22.86,25.4
  Route2 0.203: v13.59,136.4 17.15,132.84 17.15,121.03 19.49,118.69 20.57,118.69 24.37,118.69 24.83,118.24 v29.34,118.24
  Route2 0.406: v22.86,25.4 22.86,61.47 20.57,63.75 20.57,70.74 26.8,76.96 26.8,96.9 29.08,99.19 29.08,107.7 20.57,116.2 20.57,118.69
  pour Top: 25.4,20.32 25.4,11.43 26.67,10.16 34.29,10.16 34.29,20.32
CAN_RX1
  Top 0.305: U4.4 39.53,130.98 R17.2
CAN_RX_T
  Top 0.305: R17.1 34.88,131.81 34.88,138.06 36.38,139.57 40.51,139.57 U3.4
CAN_TX2
  Top 0.305: U4.1 39.53,136.99 R16.2
CAN_TX_T
  Top 0.305: U3.3 42.54,139.06 37.78,139.06 37.57,138.85 R16.1
CANH1  (via drill 0.35)
  Top 0.61: U4.7 51.99,134.62 CON2.P$3 53.36,134.6 53.66,134.3 v53.66,133.35
  Bottom 0.61: v53.66,133.35 53.66,132.4 53.34,132.08 52.03,132.08 CON3.P$3
CANL1  (via drill 0.35)
  Top 0.61: U4.6 v46.67,133.35 CON3.P$2
  Bottom 0.61: v46.67,133.35 CON3.P$2
CANSH1  (via drill 0.35)
  Top 0.61: CON2.P$1 54.31,132.1 54.61,132.4 v54.61,133.35
  Bottom 0.61: v54.61,133.35 54.61,134.3 54.31,134.6 CON3.P$1
CRITICAL_OUT  (via drill 0.35)
  Top 0.406: U1.9 14.95,141.95 v15.24,142.24 | U2.9 17.49,132.19 18.03,132.74 24.79,132.74 25.4,133.35 26.67,133.35 27.94,134.62 27.94,138.43 29.21,139.7 U3.9
  Bottom 0.406: v15.24,142.24 19.21,142.24 20,143.03 20.65,143.03 21.43,142.24 27.94,142.24 U3.9
E1
  Top 0.406: R5.2 Q1.P$3
E2
  Top 0.406: R6.2 Q2.P$3
E3
  Top 0.406: R7.2 Q3.P$3
ELECTRONICS_BATTERY  (via drill 0.35)
  Top 0.254: U5.VOUT 7.25,88.22 v6.67,87.63
  Top 0.406: U2.15 14.67,129.25 13.97,129.25 13.33,128.62 13.33,127.64 v12.7,127 | v10.16,125.73 v10.16,114.3 | v22.86,68.58 24.45,70.17 24.45,71.75 25.08,72.39 R12.P$2
  Bottom 0.406: v10.16,125.73 11.43,125.73 v12.7,127 | v10.16,114.3 10.16,102.87 5.69,98.4 5.69,66.7 6.35,66.04 20.32,66.04 v22.86,68.58 | v6.67,87.63 6.67,79.69 7.62,78.74 19.05,78.74 21.59,76.2 27.4,76.2 v27.94,76.74
  pour Top (no thermals): 29.21,91.44 33.66,91.44 33.97,91.12 33.97,67.94 33.34,67.31 25.72,67.31 25.08,67.94 25.08,87.31
G1  (via drill 0.35)
  Top 0.254: U5.G1 6.98,89.22 v6.67,89.53
  Top 0.406: v35.56,66.04 35.43,66.17 Q10.G | Q11.G 37.15,77.15 37.46,76.83 v37.46,75.88
  Bottom 0.254: v35.56,66.04 34.92,65.41 34.92,65.09 35.24,64.77 37.78,64.77 42.72,69.71 42.72,90.94 40.32,93.34 24.14,93.34 23.05,92.25 16.02,92.25 11.75,96.52 9.21,96.52 6.67,93.98 v6.67,89.53
  Bottom 0.406: v37.46,75.88 37.46,66.67 36.83,66.04 v35.56,66.04
  pour Top (no thermals): 35.24,78.1 34.61,77.47 34.61,76.83 36.83,76.83 36.83,74.93 38.1,74.93 38.1,77.47 37.46,78.1
  pour Top (no thermals): 34.61,66.04 35.24,65.41 36.2,65.41 36.2,67.94 34.61,67.94
G2  (via drill 0.35)
  Top 0.254: U5.G2 8.26,92.08 9.21,93.03 v9.21,94.93
  Top 0.406: Q13.G 36.51,91.12 v36.83,91.44 | v35.56,80.01 35.56,81.47 Q12.G
  Bottom 0.254: v36.83,91.44 35.56,92.71 24.15,92.71 23.24,91.8 15.52,91.8 11.43,95.88 9.84,95.88 9.21,95.25 v9.21,94.93
  Bottom 0.406: v36.83,91.44 37.46,90.8 37.46,81.28 36.2,80.01 v35.56,80.01
  pour Top (no thermals): 35.24,92.07 34.61,91.44 34.61,90.8 37.78,90.8 37.78,91.76 37.46,92.07
  pour Top (no thermals): 34.61,80.01 35.24,79.38 36.2,79.38 36.2,81.91 34.61,81.91
GND  (via drill 0.35)
  Top 0.254: C1.2 15.56,135.99 14.31,135.74 14.29,135.7 U1.3
  Top 0.406: U2.3 16.84,125.82 C2.2
  other vias: 41.75,130.33 41.75,129.7 40.96,134.94 40.96,134.3 23.02,143.51 44.93,146.05 17.78,2.54 52.07,21.59 52.07,128.27 52.07,138.43 5.71,150.62 7.62,85.72 18.1,81.6 14.92,89.22 12.7,115.57 13.97,102.87 19.69,100.33 49.21,111.76 36.51,112.9 17.02,117.79 19.05,127.32 17.78,138.43 32.38,134.3 24.45,135.89 9.21,98.42 51.75,51.75 51.75,37.47 12.7,91.44 13.97,110.49
  pour Top (no thermals): 47.15,117.32 47.15,120.17 43.02,120.17 43.02,117.32
  pour Bottom (no thermals): 47.15,117.32 47.15,120.17 43.02,120.17 43.02,117.32
  pour Bottom (rank 2): 56.83,0.32 56.83,160.97 0.32,160.97 0.32,0.32
  pour Top (rank 3): 56.83,0.32 56.83,160.97 0.32,160.97 0.32,0.32
HYS
  Top 0.254: R28.2 11.16,83.82 U5.HYS
I2C_3V1
  Bottom 0.508: JP5.6 19.37,149.23 20.64,150.5 33.02,150.5 | 33.02,151.45 32.07,150.5 33.02,149.54
  Bottom 0.813: JP6.7 33.02,151.45 33.02,150.5 33.02,149.54 JP6.8
MG1  (via drill 0.35)
  Top 0.406: R5.1 17.78,101.6 v16.51,100.33
  Bottom 0.406: v16.51,100.33 16.51,97.79 18.1,96.2 21.59,96.2 22.86,97.47 47.71,97.47 49.28,95.91 54.36,95.91 55.24,95.02 D1.P$1 53.2,32.05 R9.2 43.34,31.56 Q4.1G
MG2  (via drill 0.35)
  Top 0.406: R6.1 v13.97,107.95
  Bottom 0.406: v13.97,107.95 12.09,106.07 12.09,100.08 17.53,94.64 21.84,94.64 23.29,96.09 47.38,96.09 48.77,94.69 53.72,94.69 54.03,94.39 54.03,46.08 D2.P$1 51.93,46.02 R10.2 43.34,45.53 Q5.1G
MG3  (via drill 0.35)
  Top 0.406: R7.1 v13.97,114.3
  Bottom 0.406: v13.97,114.3 10.82,111.15 10.82,99.62 17.07,93.37 22.3,93.37 23.8,94.87 46.87,94.87 48.27,93.47 52.26,93.47 52.81,92.93 52.81,65.18 D3.P$1 51.43,63.8 R11.2 43.34,59.5 Q6.1G
MG4  (via drill 0.35)  (1 unrouted)
  Top 0.406: v24.13,118.11 24,118.24 R33.1
  Route2 0.406: v24.13,118.11 25.4,116.84 33.02,116.84 34.29,115.57 34.29,105.41 44.45,95.25 53.34,95.25 55.88,92.71 v55.88,20.32
  Bottom 0.406: Q15.1G 44.42,17.78 53.34,17.78 | R32.2 55.7,17.91 D4.P$1 v55.88,20.32
MOTOR1  (via drill 0.35)
  Top 0.406: U1.11 13.61,141.54 13.61,142.2 12.95,142.85 9.5,142.85 7.62,140.97 2.54,140.97 1.27,139.7 v1.27,105.41 | R8.P$1 20.32,30.48 20.96,31.11 20.96,35.24 20,36.2 4.45,36.2 v2.54,38.1
  Bottom 0.406: v2.54,38.1 1.27,39.37 v1.27,105.41
  pour Top (no thermals): 18.42,25.4 8.26,25.4 7.62,26.04 7.62,34.93 8.26,35.56 19.69,35.56 20.32,34.93 20.32,27.3
MOTOR2  (via drill 0.35)
  Top 0.406: U1.14 10.48,140.03 9.53,139.06 9.53,135.25 7.62,133.35 3.81,133.35 2.54,132.08 v2.54,106.68 | v2.54,53.34 5.71,50.16 20,50.16 20.96,49.21 20.96,45.09 20.32,44.45 R4.P$1
  Bottom 0.406: v2.54,53.34 1.91,53.98 1.91,102.55 2.54,103.19 v2.54,106.68
  pour Top (no thermals): 19.69,39.37 8.26,39.37 7.62,40.01 7.62,48.9 8.26,49.53 19.69,49.53 20.32,48.9 20.32,40.01
MOTOR3  (via drill 0.35)
  Top 0.406: U2.11 16.19,132.41 15.85,132.74 6.35,132.74 3.81,130.2 v3.81,107.95 | R13.P$1 20.32,58.42 20.96,59.05 20.96,63.18 20,64.13 5.71,64.13 4.45,62.87 v3.81,62.87
  Bottom 0.406: v3.81,107.95 3.81,102.87 2.54,101.6 2.54,64.13 v3.81,62.87
  pour Top (no thermals): 19.69,53.34 8.26,53.34 7.62,53.98 7.62,62.87 8.26,63.5 19.69,63.5 20.32,62.87 20.32,53.98
MOTOR4  (via drill 0.35)
  Top 0.203: J11.1 4.7,23.88 v3.3,23.88 | v12.83,133.94 12.83,137.73 U1.1
  Route2 0.203: v3.3,23.88 3.3,62.55 3.23,62.62 3.23,64.22 3.86,64.85 3.86,107.08 3.23,107.71 3.23,127.56 9.6,133.94 v12.83,133.94
  pour Top: 7.62,21.59 20.32,21.59 20.32,12.7 19.05,11.43 7.62,11.43
N$1
  Top 0.406: R1.2 41.58,99.73 Q1.P$1
N$2
  Top 0.406: R2.2 Q2.P$1
N$3
  Top 0.406: R3.2 41.58,111.09 Q3.P$1
N$4  (via drill 0.35)
  Top 0.406: JP3.1 JP1.1 | v42.54,102.55 42.53,102.55 Q1.P$2 41.58,101.61 40,103.19 40,106.38 Q2.P$2 40,109.52 40,112.72 Q3.P$2 40.64,114.3 39.37,115.57 39.37,118.44 Q16.P$2
  Bottom 0.406: v42.54,102.55 47.31,102.55 48.26,101.6 48.26,99.06 49.53,97.79 JP3.1
N$5
  Top 0.406: JP2.2 52.07,101.6 JP3.2
N$6  (via drill 0.35)
  Top 0.406: v41.91,50.8 40.13,50.8 Q7.G
  Bottom 0.406: R19.2 42.67,51.57 v41.91,50.8
N$7  (via drill 0.35)
  Top 0.406: v41.91,64.77 40.64,64.77 36.2,60.33 Q14.G
  Bottom 0.406: R20.2 42.67,65.53 v41.91,64.77
N$8
  Top 0.406: R29.1 43.23,96.52 LED1.A
N$9  (via drill 0.35)
  Top 0.406: Q9.G 40.13,36.83 v41.91,36.83
  Bottom 0.406: R21.2 42.67,37.59 v41.91,36.83
N$10  (via drill 0.35)  (1 unrouted)
  Top 0.406: Q8.G 40.13,21.59 v41.91,21.59
  Bottom 0.406: v41.91,21.59 43.18,22.86 44.45,22.86
N$11
  Top 0.406: R30.1 43.23,93.98 LED2.A
N$14
  Top 0.254: C5.1 12.06,85.31 U5.TMR
N$15
  Top 0.406: R33.2 Q16.P$3
N$16  (1 unrouted)
  Top 0.406: Q16.P$1 41.58,115.9 42.59,114.9 42.59,114.89 44.45,113.03 44.45,110.49
NIU  (via drill 0.35)
  Top 0.254: U5.!SHDN U5.EN v10.16,85.09 8.89,83.82 C6.1 | U5.INTVCC 9.16,91.71 v10.79,93.34
  Bottom 0.254: v10.16,85.09 10.16,86.36 10.79,86.99 v10.79,93.34
OV1
  Top 0.254: U5.OV1 12.1,89.17 13.07,89.17 13.79,88.45 13.79,87.81 14.29,87.31 16.46,87.31 R23.1
  Top 0.406: R24.2 16.78,87.63 R23.1
OV2
  Top 0.254: U5.OV2 12.75,90.22 14.97,92.44 R26.1
  Top 0.406: R27.2 16.78,92.71 R26.1
POWER_BOARD  (via drill 0.35)
  Top 0.406: U2.14 13.03,129.87 12.7,129.54 12.7,128.27 11.43,127 v11.43,124.46 13.97,124.46 15.54,126.02 U2.1 | R12.P$1 20.32,72.39 20.96,71.75 20.96,67.31 18.42,64.77 3.59,64.77 v3.27,65.09
  Bottom 0.406: v11.43,124.46 6.35,124.46 5.08,123.19 5.08,102.87 3.17,100.96 3.17,65.19 v3.27,65.09
  pour Top (no thermals): 19.69,67.31 8.26,67.31 7.62,67.94 7.62,77.79 8.26,78.42 19.69,78.42 20.32,77.79 20.32,67.94
PV_OUT  (via drill 0.35)
  Top 0.406: U1.10 14.29,142.56 15.24,143.51 v16.51,143.51 | U2.10 16.84,132.41 17.78,133.35 24.13,133.35 v25.4,134.62
  Bottom 0.152: 19.05,144.87 17.87,144.87 v16.51,143.51
  Bottom 0.406: v25.4,134.62 26.67,135.89 30.07,135.89 32.36,138.18 32.36,139.04 U3.7 30.39,144.87 19.05,144.87
SCL  (via drill 0.35)
  Top 0.305: v31.75,130.81 30.99,131.57 30.99,138.46 33.02,140.49 33.02,144.63 29.85,147.8 R14.2 31.59,149.07 32.56,148.11 34.44,148.11 JP6.6
  Top 0.406: U2.6 26.35,129.22 v26.67,129.54 | U1.6 18.92,139.38 19.82,138.48 20.27,138.48 21.59,137.16 v21.59,135.89
  Bottom 0.305: v31.75,130.81 U3.19/A5
  Bottom 0.406: JP6.6 JP6.5 | v31.75,130.81 30.48,132.08 29.21,132.08 v26.67,129.54 26.67,130.65 24.74,132.58 24.74,133.85 22.7,135.89 v21.59,135.89
SCL_3V1
  Top 0.406: JP5.2 25.4,150.5 28.26,150.5 29.68,151.92 R14.1
SDA  (via drill 0.35)
  Top 0.305: v30.48,130.81 30.48,144.78 27.31,147.96 R15.2 27.63,149.07 29.05,150.5 36.83,150.5 JP6.4
  Top 0.406: U2.7 19.69,129.87 19.98,130.15 22.84,130.15 23.5,130.81 v24.13,130.81 | U1.7 19.13,140.03 20.07,139.09 22.2,139.09 22.86,138.43 v22.86,134.62
  Bottom 0.305: 32.38,127.64 30.48,129.54 | 32.7,127.32 32.38,127.64 | 32.7,127.32 33.02,127 | 32.38,127.32 32.38,127.64 | 32.38,127.32 32.38,127 32.7,127.32 | 31.75,127 32.07,127 32.38,127.32
  Bottom 0.406: JP6.4 JP6.3 | 33.02,127 32.38,127 31.75,127 25.08,127 24.13,127.95 v24.13,130.81 24.13,133.35 v22.86,134.62 | 33.02,127 U3.18/A4 | 33.02,127 30.48,129.54 v30.48,130.81
SDA_3V1
  Top 0.406: JP5.4 22.96,150.6 24.61,150.6 25.93,151.92 R15.1
STB1
  Top 0.305: R18.2 44.92,137.79 U4.8
TC_OUT  (via drill 0.35)
  Top 0.406: U1.13 11.88,140.97 v10.16,140.97 | U2.13 14.27,130.52 v13.97,130.81
  Bottom 0.406: v10.16,140.97 8.89,139.7 8.89,138.43 10.16,137.16 21.59,137.16 | 21.59,137.16 30.48,137.16 31.75,138.43 U3.8 | v13.97,130.81 13.97,133.35 14.63,134.01 17.78,134.01 18.44,134.01 21.59,137.16
UV1
  Top 0.254: R23.2 14.97,85.36 13.33,86.99 13.33,88.27 12.88,88.72 U5.UV1
  Top 0.406: R23.2 18.63,85.36 R22.1
UV2
  Top 0.254: U5.UV2 13.52,89.72 14.24,90.44 R26.2
  Top 0.406: R25.1 16.78,90.17 R26.2
VIN  (via drill 0.35)
  Top 0.61: U4.3 v38.42,133.35 37.15,133.35 36.95,133.07 C4.1
  Top 1.27: U3.VIN 55.24,125.09 JP4.1
  Bottom 0.61: U3.VIN 53.83,125.73 52.59,126.97 39.71,126.97 38.42,128.27 v38.42,133.35
VS1  (via drill 0.35)
  Top 0.254: U5.VS1 4.84,88.72 C9.1 4.66,89.07 3.56,90.17 1.91,90.17 1.27,90.8 1.27,93.98 3.81,96.52 v7.3,96.52 | Q11.S@1 35.37,72.58 v35.56,72.39
  Bottom 0.254: v35.56,72.39 33.02,69.85 33.02,64.77 33.66,64.13 38.1,64.13 43.18,69.21 43.18,91.44 40.64,93.98 24.13,93.98 22.86,92.71 16.51,92.71 12.06,97.16 7.94,97.16 v7.3,96.52
  pour Top (no thermals): 34.61,76.2 36.2,76.2 36.2,68.58 34.61,68.58
VS2  (via drill 0.35)
  Top 0.254: U5.VS2 7.82,89.72 7.58,89.96 7.58,90.21 6.35,91.44 C10.1 4.66,92.61 5.71,93.66 v7.94,93.66
  Top 0.406: Q13.S@1 35.37,86.55 v35.56,86.36
  Bottom 0.254: v35.56,86.36 36.83,87.63 36.83,90.17 34.92,92.07 24.45,92.07 23.71,91.34 15.02,91.34 11.75,94.61 10.48,94.61 9.53,93.66 v7.94,93.66
  pour Top (no thermals): 34.61,90.17 36.2,90.17 36.2,82.55 34.61,82.55
WALL  (via drill 0.35)
  Top 0.254: U5.V1 9.66,86.18 8.26,84.77 5.82,84.77 5.08,84.03 C7.1
  Top 0.406: R22.2 21.74,82.7 v20.32,81.28 19.05,80.01 7.62,80.01 6.98,80.64 6.98,82.55 6.13,83.4 C7.1 | v39.37,72.39 39.37,70.11 Q10.D@5
  Bottom 0.406: v39.37,72.39 39.37,76.2 38.1,77.47 24.13,77.47 v20.32,81.28
  pour Top (no thermals): 48.89,67.31 37.46,67.31 36.83,67.94 36.83,71.12 44.13,78.42 48.89,78.42 49.53,77.79 49.53,67.94
WARNING_OUT  (via drill 0.35)
  Top 0.406: U1.8 19.35,140.68 20.32,139.7 25.4,139.7 | U3.10 25.4,139.7 | U2.8 18.76,130.52 20.32,132.08 v26.67,132.08 | v26.67,134.62 25.4,135.89 25.4,139.7
  Bottom 0.406: v26.67,132.08 27.31,132.08 27.94,132.72 27.94,133.35 v26.67,134.62
(copper drawn outside any net)
  shapes: Top area x3

### Text on the board
tPlace: ARVP BATTERY VOLTAGE MONITORING | REV 1.2 12/2017 | M. Blenkinsopp | M. Farow | E Battery | WALL
tNames: I2C | I2C / PWR | 3V3 | SDA | SCL | 3V3 | SCL | SDA | GND | 3V3 | SHORT JP4 / WHEN USB NOT / IN USE | H | CAN | L | S | + / E.B / - | + / W / - | + / PB / - | + / M / - | + / B2 / - | + / M / - | + / B3 / - | + / M / - | + / B4 / - | MAX 40A/BATTERY
bNames: S | CAN | L | H